# Altium schematic sheet 采集.SchDoc
size A3
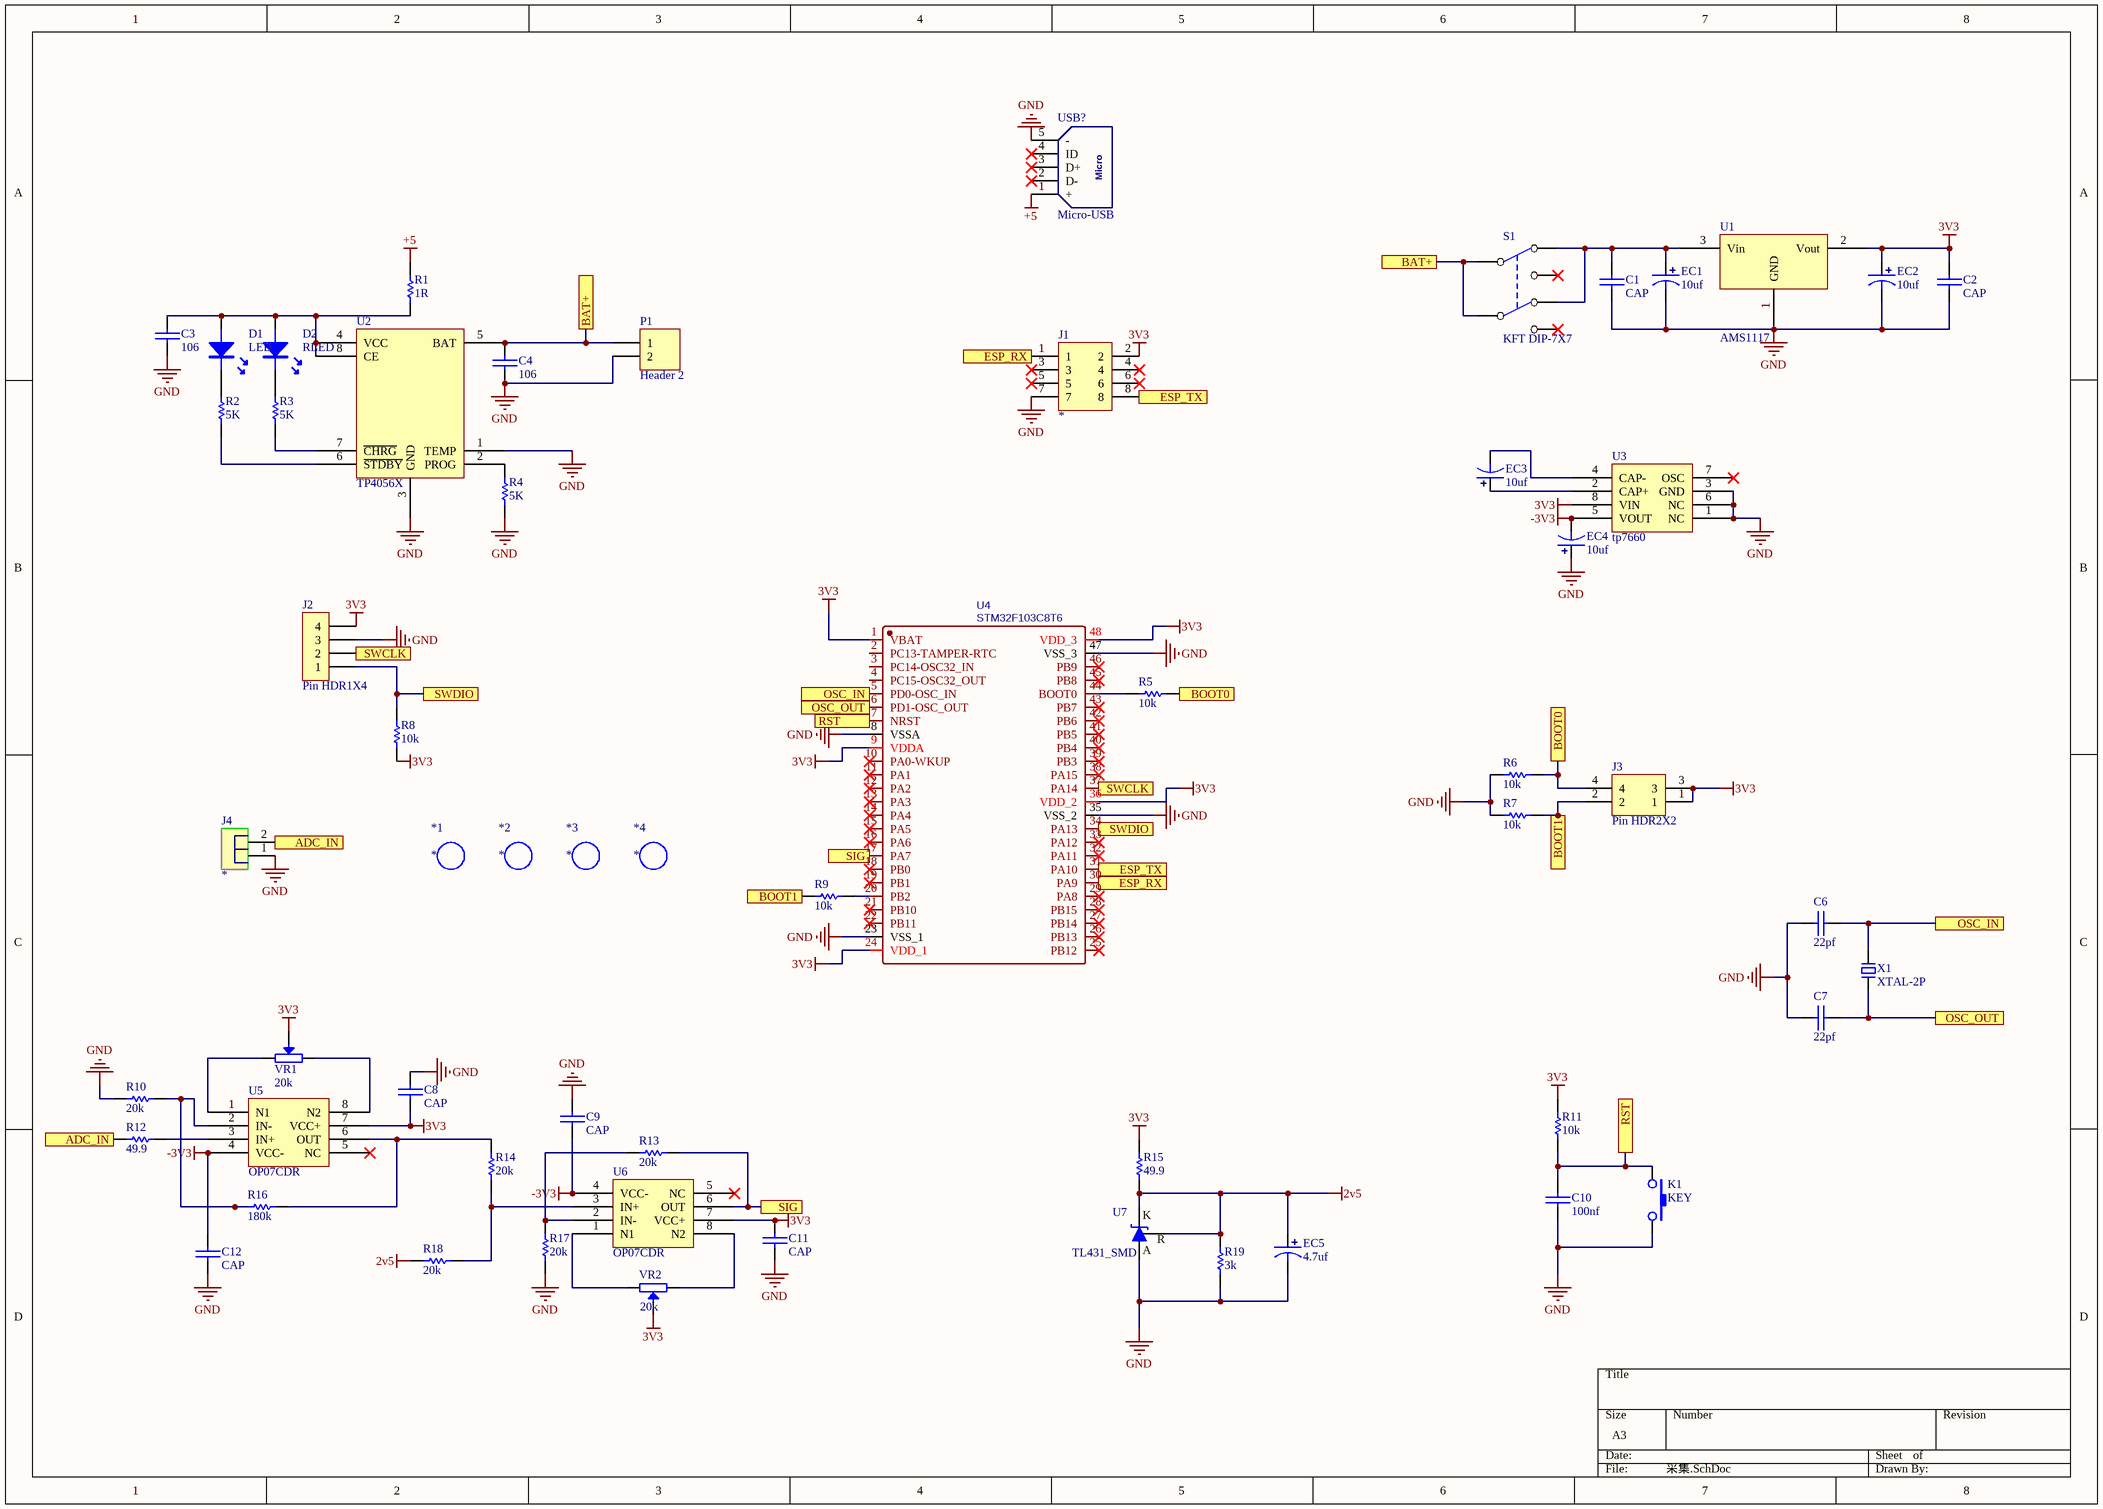
[diagram p0: 采集.SchDoc]

## Parts
*1  *  [M3 125X200]
*2  *  [M3 125X200]
*3  *  [M3 125X200]
*4  *  [M3 125X200]
C1  CAP  [0603C]
C2  CAP  [0603C]
C3  106  [0603C]
C4  106  [0603C]
C6  22pf  [0603C]
C7  22pf  [0603C]
C8  CAP  [0603C]
C9  CAP  [0603C]
C10  100nf  [0603C]
C11  CAP  [0603C]
C12  CAP  [0603C]
D1  LED  [LED-0603G]
D2  RLED  [LED-0603Y]
EC1  10uf  [DIP-EC1.5X4X8]
EC2  10uf  [DIP-EC1.5X4X8]
EC3  10uf  [DIP-EC1.5X4X8]
EC4  10uf  [DIP-EC1.5X4X8]
EC5  4.7uf  [DIP-EC1.5X4X8]
J1  *  [Fe-HDR2X4/2.54-S]
J2  Pin HDR1X4  [Pin HDR1X4/2.54mm-S]
J3  Pin HDR2X2  [Pin HDR2X2/2.54mm-S]
J4  *  [KF128-3.81-2P]
K1  KEY  [DIP-6X6X5]
P1  Header 2  [HDR1X2]
R1  1R  [0603R]
R2  5K  [0603R]
R3  5K  [0603R]
R4  5K  [0603R]
R5  10k  [0603R]
R6  10k  [0603R]
R7  10k  [0603R]
R8  10k  [0603R]
R9  10k  [0603R]
R10  20k  [0603R]
R11  10k  [0603R]
R12  49.9  [0603R]
R13  20k  [0603R]
R14  20k  [0603R]
R15  49.9  [0603R]
R16  180k  [0603R]
R17  20k  [0603R]
R18  20k  [0603R]
R19  3k  [0603R]
S1  KFT DIP-7X7  [KFT DIP-7X7]
U1  AMS1117  [SOT223]
U2  TP4056X  [SOP8]
U3  tp7660  [SOP8]
U4  STM32F103C8T6  [LQFP48 7X7]
U5  OP07CDR  [SOP8]
U6  OP07CDR  [SOP8]
U7  TL431_SMD  [SOT23]
USB?  Micro-USB  [USB-micro_B]
VR1  20k  [3296W]
VR2  20k  [3296W]
X1  XTAL-2P  [OSC HC-49S]

## Ports
ADC_IN, BAT+, BOOT0, BOOT1, ESP_RX, ESP_TX, OSC_IN, OSC_OUT, RST, SIG, SWCLK, SWDIO

## Nets
2v5: EC5.1 R15.2 R18.2 R19.1 U7.K U7.R
3V3: C2.2 C8.1 C11.2 EC2.1 J1.2 J2.4 J3.1 J3.3 R8.1 R11.2 R15.1 U1.2(Vout) U3.8(VIN) U4.1(VBAT) U4.9(VDDA) U4.24(VDD_1) U4.36(VDD_2) U4.48(VDD_3) U5.7(VCC+) U6.7(VCC+) VR1.2 VR2.2
+5: R1.2 USB?.1(+)
-3V3: C9.1 C12.2 EC4.2 U3.5(VOUT) U5.4(VCC-) U6.4(VCC-)
GND: C1.1 C2.1 C3.1 C4.1 C6.2 C7.2 C8.2 C9.2 C10.1 C11.1 C12.1 EC1.2 EC2.2 EC4.1 EC5.2 J1.7 J2.3 J4.1 K1.3 P1.2 R4.1 R6.1 R7.1 R10.1 R17.1 R19.2 U1.1(GND) U2.1(TEMP) U2.3(GND) U3.1(NC) U3.3(GND) U3.6(NC) U4.8(VSSA) U4.23(VSS_1) U4.35(VSS_2) U4.47(VSS_3) U7.A USB?.5(-)
ADC_IN: J4.2 R12.1 ; port ADC_IN
BAT+: C4.2 P1.1 S1.2 S1.5 U2.5(BAT) ; port BAT+
BOOT0: J3.4 R5.2 R6.2 ; port BOOT0
BOOT1: J3.2 R7.2 R9.1 ; port BOOT1
ESP_RX: J1.1 U4.30(PA9) ; port ESP_RX
ESP_TX: J1.8 U4.31(PA10) ; port ESP_TX
OSC_IN: C6.1 U4.5(PD0-OSC_IN) X1.2 ; port OSC_IN
OSC_OUT: C7.1 U4.6(PD1-OSC_OUT) X1.1 ; port OSC_OUT
RST: C10.2 K1.1 R11.1 U4.7(NRST) ; port RST
SIG: R13.1 U4.17(PA7) U6.6(OUT) ; port SIG
SWCLK: J2.2 U4.37(PA14) ; port SWCLK
SWDIO: J2.1 R8.2 U4.34(PA13) ; port SWDIO
NetC1_2: C1.2 EC1.1 S1.3 S1.4 U1.3(Vin)
NetC3_2: C3.2 D1.A D2.A R1.1 U2.4(VCC) U2.8(CE)
NetD1_K: D1.K R2.2
NetD2_K: D2.K R3.2
NetEC3_1: EC3.1 U3.2(CAP+)
NetEC3_2: EC3.2 U3.4(CAP-)
NetR2_1: R2.1 U2.6(~{STDBY})
NetR3_1: R3.1 U2.7(~{CHRG})
NetR4_2: R4.2 U2.2(PROG)
NetR5_1: R5.1 U4.44(BOOT0)
NetR9_2: R9.2 U4.20(PB2)
NetR10_2: R10.2 R16.1 U5.2(IN-)
NetR12_2: R12.2 U5.3(IN+)
NetR13_2: R13.2 R17.2 U6.2(IN-)
NetR14_1: R14.1 R18.1 U6.3(IN+)
NetR14_2: R14.2 R16.2 U5.6(OUT)
NetU5_1: U5.1(N1) VR1.1
NetU5_8: U5.8(N2) VR1.3
NetU6_1: U6.1(N1) VR2.3
NetU6_8: U6.8(N2) VR2.1

Not connected (* = marked no-connect by the designer): J1 3* 4* 5* 6*; S1 1* 6*; U3 7(OSC)*; U4 2(PC13-TAMPER-RTC) 3(PC14-OSC32_IN) 4(PC15-OSC32_OUT) 10(PA0-WKUP)* 11(PA1)* 12(PA2)* 13(PA3)* 14(PA4)* 15(PA5)* 16(PA6)* 18(PB0)* 19(PB1)* 21(PB10)* 22(PB11)* 25(PB12)* 26(PB13)* 27(PB14)* 28(PB15)* 29(PA8)* 32(PA11)* 33(PA12)* 38(PA15)* 39(PB3)* 40(PB4)* 41(PB5)* 42(PB6)* 43(PB7)* 45(PB8)* 46(PB9)*; U5 5(NC)*; U6 5(NC)*; USB? 2(D-)* 3(D+)* 4(ID)*

## Notes on the sheet
- (in symbol Micro-USB) Micro

## Library data of the parts
*1-*4 = M3: 铜柱孔; 版权归属: 源创客; BOM名称: 铜柱孔; 学习资源: www.ooocke.com
C1-C4 C6-C12 = CAP: 无极性电容
D2 = LED
EC1-EC5 = DIP_ECAP: 直插电解电容
J1 = Female HDR2X4
J4 = KF128-2P
P1 = Header 2: Header, 2-Pin; LatestRevisionDate: 17-Jul-2002; LatestRevisionNote: Re-released for DXP Platform.; Publisher: Altium Limited
R1-R19 = RES
U1 = AMS1117: 三端稳压芯片
U2 = TP4056
U4 = STM32F103C8T6: BOM_Manufacturer: STMicroelectronics; timeStamp: 1455028086; BOM_Supplier: LCSC; BOM_Manufacturer Part: STM32F103C8T6; BOM_Supplier Part: C8734; BOM_JLCPCB Part Class: Basic Part; spicePre: U; spiceSymbolName: STM32F103C8T6
U7 = TL431_SMD: 可调基准稳压芯片; pin to pad: A>D K>G R>S
VR1 VR2 = RESVR
X1 = XTAL-2P: 2脚无源脚晶振